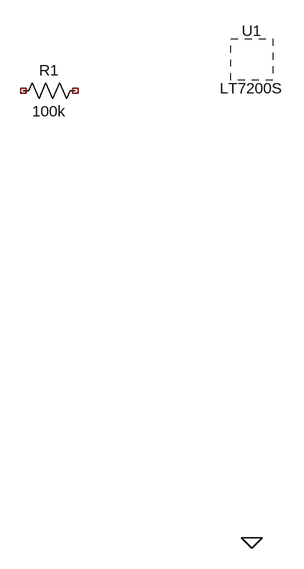
[diagram p0: schematic Draft1.asc]
Draft1.asc, the LTspice schematic file:
Version 4.1
SHEET 1 880 932
FLAG 80 912 0
SYMBOL PowerProducts\\LT7200S 80 176 R0
SYMATTR InstName U1
SYMBOL res -176 208 R90
WINDOW 0 0 56 VBottom 2
WINDOW 3 32 56 VTop 2
SYMATTR InstName R1
SYMATTR Value 100k

The netlist it stands for:
* Draft1.asc
* U1: LT7200S (symbol PowerProducts\LT7200S not available, pin order unknown); nets seen at it: 
R1 NC_01 NC_02 100k
.backanno
.end